# Altium schematic sheet 5_Limit_Switches.SchDoc
size B
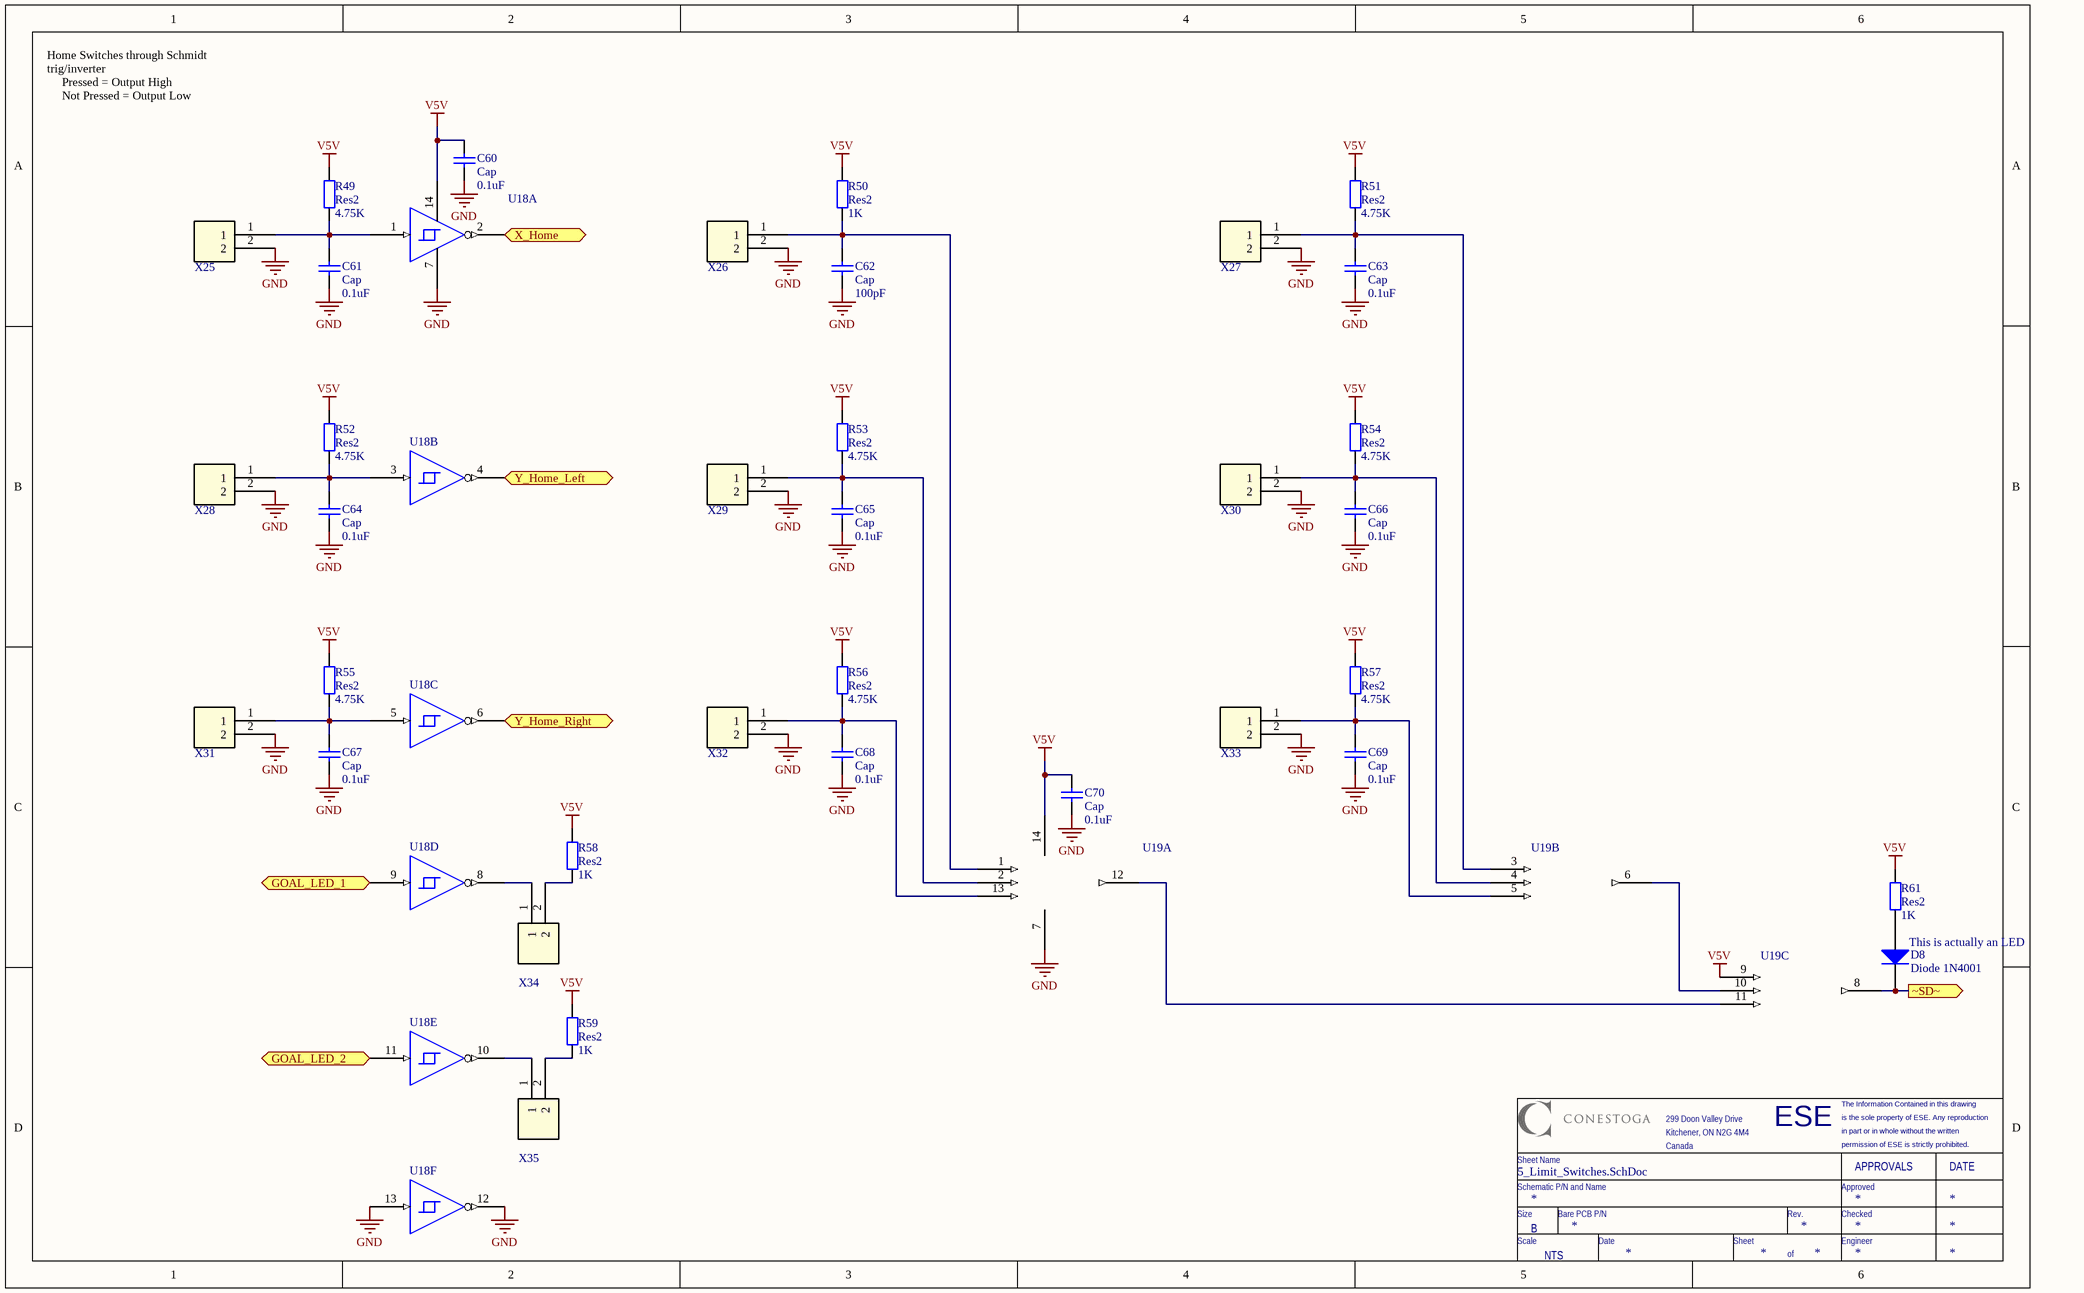
[diagram p0: 5_Limit_Switches.SchDoc]

## Parts
C60  Cap  value 0.1uF  [RAD-0.3]
C61  Cap  value 0.1uF  [RAD-0.3]
C62  Cap  value 100pF  [RAD-0.3]
C63  Cap  value 0.1uF  [RAD-0.3]
C64  Cap  value 0.1uF  [RAD-0.3]
C65  Cap  value 0.1uF  [RAD-0.3]
C66  Cap  value 0.1uF  [RAD-0.3]
C67  Cap  value 0.1uF  [RAD-0.3]
C68  Cap  value 0.1uF  [RAD-0.3]
C69  Cap  value 0.1uF  [RAD-0.3]
C70  Cap  value 0.1uF  [RAD-0.3]
D8  Diode 1N4001  [DO-41]
R49  Res2  value 4.75K  [AXIAL-0.4]
R50  Res2  value 1K  [AXIAL-0.4]
R51  Res2  value 4.75K  [AXIAL-0.4]
R52  Res2  value 4.75K  [AXIAL-0.4]
R53  Res2  value 4.75K  [AXIAL-0.4]
R54  Res2  value 4.75K  [AXIAL-0.4]
R55  Res2  value 4.75K  [AXIAL-0.4]
R56  Res2  value 4.75K  [AXIAL-0.4]
R57  Res2  value 4.75K  [AXIAL-0.4]
R58  Res2  value 1K  [AXIAL-0.4]
R59  Res2  value 1K  [AXIAL-0.4]
R61  Res2  value 1K  [AXIAL-0.4]
U18  IC HEX SCHMITT-TRIG INV 14-DIP  [14-DIP]  (value not drawn)  (parts A,B,C,D,E,F of 6)
U19  IC GATE AND 3CH 3-INP 14DIP  [14-DIP]  (value not drawn)  (parts A,B,C of 3)
X25  TERM BLOCK HDR 2POS VERT 3.5MM  [WR-TBL-3211 2]  (value not drawn)
X26  TERM BLOCK HDR 2POS VERT 3.5MM  [WR-TBL-3211 2]  (value not drawn)
X27  TERM BLOCK HDR 2POS VERT 3.5MM  [WR-TBL-3211 2]  (value not drawn)
X28  TERM BLOCK HDR 2POS VERT 3.5MM  [WR-TBL-3211 2]  (value not drawn)
X29  TERM BLOCK HDR 2POS VERT 3.5MM  [WR-TBL-3211 2]  (value not drawn)
X30  TERM BLOCK HDR 2POS VERT 3.5MM  [WR-TBL-3211 2]  (value not drawn)
X31  TERM BLOCK HDR 2POS VERT 3.5MM  [WR-TBL-3211 2]  (value not drawn)
X32  TERM BLOCK HDR 2POS VERT 3.5MM  [WR-TBL-3211 2]  (value not drawn)
X33  TERM BLOCK HDR 2POS VERT 3.5MM  [WR-TBL-3211 2]  (value not drawn)
X34  TERM BLOCK HDR 2POS VERT 3.5MM  [WR-TBL-3211 2]  (value not drawn)
X35  TERM BLOCK HDR 2POS VERT 3.5MM  [WR-TBL-3211 2]  (value not drawn)

## Ports
GOAL_LED_1 (in), GOAL_LED_2 (in), X_Home (out), Y_Home_Left (out), Y_Home_Right (out), ~SD~ (out)

## Nets
GND: C60.1 C61.1 C62.1 C63.1 C64.1 C65.1 C66.1 C67.1 C68.1 C69.1 C70.1 U18.7(GND_POWER) U18.12(Y) U18.13(A) U19.7(GND_POWER) X25.2 X26.2 X27.2 X28.2 X29.2 X30.2 X31.2 X32.2 X33.2
V5V: C60.2 C70.2 R49.2 R50.2 R51.2 R52.2 R53.2 R54.2 R55.2 R56.2 R57.2 R58.2 R59.2 R61.2 U18.14(VCC) U19.9(3A) U19.14(VCC)
GOAL_LED_1: U18.9(A) ; port GOAL_LED_1
GOAL_LED_2: U18.11(A) ; port GOAL_LED_2
X_Home: U18.2(Y) ; port X_Home
Y_Home_Left: U18.4(Y) ; port Y_Home_Left
Y_Home_Right: U18.6(Y) ; port Y_Home_Right
~SD~: D8.2(K) U19.8(3Y) ; port ~SD~
NetC61_2: C61.2 R49.1 U18.1(A) X25.1
NetC62_2: C62.2 R50.1 U19.1(1A) X26.1
NetC63_2: C63.2 R51.1 U19.3(2A) X27.1
NetC64_2: C64.2 R52.1 U18.3(A) X28.1
NetC65_2: C65.2 R53.1 U19.2(1B) X29.1
NetC66_2: C66.2 R54.1 U19.4(2B) X30.1
NetC67_2: C67.2 R55.1 U18.5(A) X31.1
NetC68_2: C68.2 R56.1 U19.13(1C) X32.1
NetC69_2: C69.2 R57.1 U19.5(2C) X33.1
NetD8_1: D8.1(A) R61.1
NetR58_1: R58.1 X34.2
NetR59_1: R59.1 X35.2
NetU18_8: U18.8(Y) X34.1
NetU18_10: U18.10(Y) X35.1
NetU19_6: U19.6(2Y) U19.10(3B)
NetU19_11: U19.11(3C) U19.12(1Y)

## Notes on the sheet
- Home Switches through Schmidt trig/inverter
  Pressed = Output High
  Not Pressed = Output Low
  Limit Switches through AND gates
  Any switch pressed = Low output
  Low output send to SD pin on half bridge drivers
- (near D8) This is actually an LED
- ESE
- is the sole property of ESE. Any reproduction
- The Information Contained in this drawing
- Schematic P/N and Name
- Sheet Name
- 299 Doon Valley Drive
- Kitchener, ON N2G 4M4
- Canada
- Approved
- in part or in whole without the written
- permission of ESE is strictly prohibited.
- APPROVALS
- DATE
- Size
- Scale
- B
- NTS
- Bare PCB P/N
- Date
- Sheet
- Rev.
- Checked
- Engineer
- of

## Library data of the parts
C60-C70 = Cap: Capacitor; Published: 8-Jun-2000; LatestRevisionDate: 17-Jul-2002; LatestRevisionNote: Re-released for DXP Platform.; PackageReference: RAD-0.3; Publisher: Altium Limited; PackageDescription: Radial Cap, Thru-Hole; 2 Leads; 0.3 in Pin Spacing
D8 = Diode 1N4001: 1 Amp General Purpose Rectifier; Published: 8-Jun-2000; LatestRevisionDate: 17-Jul-2002; LatestRevisionNote: Re-released for DXP Platform.; DatasheetVersion: 1998; PackageVersion: Aug-1999; PackageReference: DO-41; Publisher: Altium Limited; PackageDescription: Diode, Axial; Body 5.2 x 2.7 mm (LxDia. max), Lead Dia. 0.86 mm (max); Code_JEDEC: DO-204-AL; ComponentLink1Description: Manufacturer Link; ComponentLink1URL: http://www.fairchildsemi.com/; ComponentLink2Description: Datasheet; ComponentLink2URL: http://www.fairchildsemi.com/ds/1N%2F1N4001.pdf
R49-R59 R61 = Res2: Resistor; Published: 8-Jun-2000; LatestRevisionDate: 17-Jul-2002; LatestRevisionNote: Re-released for DXP Platform.; PackageReference: AXIAL-0.4; Publisher: Altium Limited; PackageDescription: Axial Device, Thru-Hole; 2 Leads; 0.4 in Pin Spacing
U18 = IC HEX SCHMITT-TRIG INV 14-DIP: Manufactuer_Part_Number: SN74ACT14N; Manufacturer: Texas Instruments; Digi-Key_Part_Number: 296-4368-5-ND
U19 = IC GATE AND 3CH 3-INP 14DIP: Manufactuer_Part_Number: SN74HC11N; Manufacturer: Texas Instruments; Digi-Key_Part_Number: 296-8217-5-ND
X25-X35 = TERM BLOCK HDR 2POS VERT 3.5MM: Manufacturer_Part_Number: 691321100002; Manufacturer: Wurth Electronics Inc; DigiKey_Part_Number: 732-2763-ND